# Altium schematic sheet UART.SchDoc
size A4
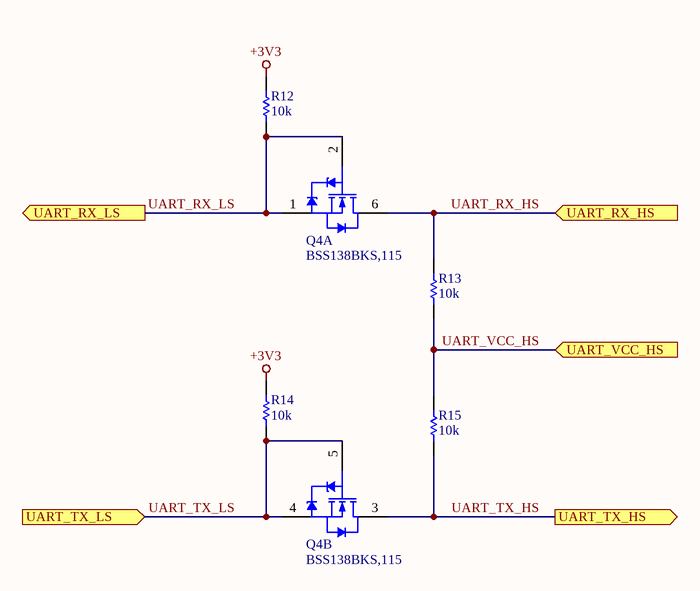
[diagram p0: UART.SchDoc]

## Parts
Q4  BSS138BKS,115  [NXP-SOT363_L]  (parts A,B of 2)
R12  10k  [RESC1609X55X30LL15T15]
R13  10k  [RESC1609X55X30LL15T15]
R14  10k  [RESC1609X55X30LL15T15]
R15  10k  [RESC1609X55X30LL15T15]

## Ports
UART_RX_HS (in), UART_RX_LS (out), UART_TX_HS (out), UART_TX_LS (in), UART_VCC_HS (in)

## Nets
+3V3: R12.2 R14.2
UART_RX_HS: Q4.6(D1) R13.2 ; port UART_RX_HS
UART_RX_LS: Q4.1(S1) Q4.2(G1) R12.1 ; port UART_RX_LS
UART_TX_HS: Q4.3(D2) R15.1 ; port UART_TX_HS
UART_TX_LS: Q4.4(S2) Q4.5(G2) R14.1 ; port UART_TX_LS
UART_VCC_HS: R13.1 R15.2 ; port UART_VCC_HS

## Library data of the parts
Q4 = CMP-1259-00117-1: Dual N-Channel Trench MOSFET, 60 V, 0.32 A, -55 to 150 degC, 6-Pin SOT363, Tape and Reel; Manufacturer: NXP Semiconductors; IDM [max] (A): 1.2; Automotive Qualified: Y; Channel Type: N; Packing: Tape & Reel; ID [max] (A): 0.32; VGSth [typ] (V): 1.1; VDS [max] (V): 60; ComponentLink2Description: Datasheet; Mounting Technology: Surface Mount; ComponentLink2URL: http://www.nxp.com/documents/data_sheet/BSS138BKS.pdf; ComponentLink3Description: Package Specification; Code_JEITA: SC-88; PartNumber: BSS138BKS,115; PackageVersion: 06-03-16, 03/2006; ComponentLink1Description: Manufacturer URL; ComponentLink1URL: http://www.nxp.com/; PackageDescription: 6-Pin Small Outline Transistor Package, Body 2 x 1.25 mm, Pitch 0.65 mm; PackageReference: SOT363; ComponentLink3URL: http://www.nxp.com/documents/outline_drawing/sot363_po.pdf; DatasheetVersion: Rev. 1
R12-R15 = CMP-2000-07452-1: Chip Resistor, 10 KOhm, +/- 1%, 0.1 W, -55 to 155 degC, 0603 (1608 Metric), RoHS, Tape and Reel; Manufacturer: Panasonic; Voltage Rating: 75V; Case\/Package: 0603; Power Rating: 100mW; Resistance: 10KOhm; Temperature Coefficient: 100ppm\/degreesC; Number of Pins: 2; Package Reference: 603; Depth: 0.8mm; Mount: SurfaceMount; Package Description: 2-Pin Surface Mount Device, Body 1.6 x 0.85 mm; Datasheet Version: 02/2017; Length: 1.6mm; Lead Free: LeadFree; Height: 0.45mm; Number of Terminations: 2; Max Power Dissipation: 100mW; Min Operating Temperature: -55degC; Datasheet URL: https://industrial.panasonic.com/cdbs/www-data/pdf/RDA0000/AOA0000C304.pdf; Termination: SMD/SMT; Case Code (Metric): 1608; Case Code (Imperial): 0603; Tolerance: 1%; Max Operating Temperature: 155degC; RoHSCompliant: true; Voltage Rating (DC): 75V; Radiation Hardening: No; Packaging: TapeandReel; Composition: ThickFilm; Mounting Technology: SurfaceMount; Manufacturer URL: http://www.panasonic.com/; Width: 0.031inch; REACH SVHC: NoSVHC; Contact Plating: Tin; Military Standard: Not; Package Quantity: 1